# Altium project PIC.PrjPCB
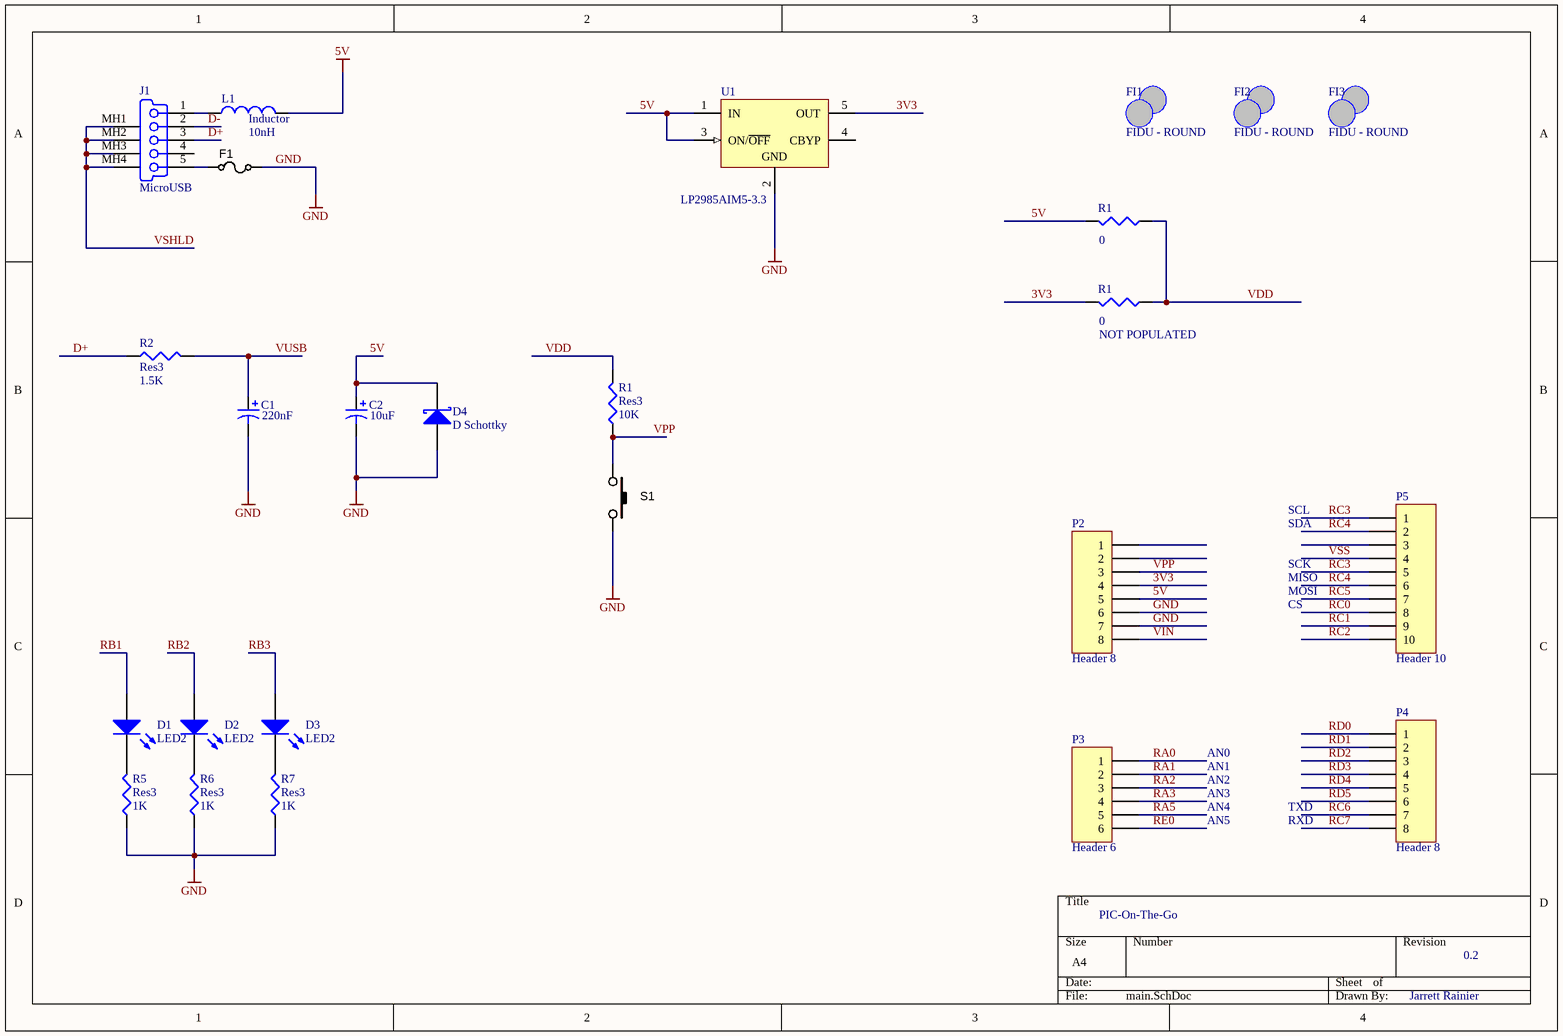
[diagram p0: main.SchDoc]
drawnBy: Jarrett Rainier; Title: HI
2 sheets, 32 parts. Net scope: global (net labels, ports and power ports of the same name join across sheets).
Board files: PCB1.PcbDoc, Panelized.PcbDoc
Sheets:
  main.SchDoc
  micros.SchDoc

## Sheet main.SchDoc: PIC-On-The-Go
size A4; Date: 5/12/15; DrawnBy: Jarrett Rainier; Revision: 0.2; SheetNumber: 1; SheetTotal: 2

### Parts
(Parts that share a designator on the sheet are numbered #1, #2 ... from top to bottom, then left to right.)
C1  value 220nF  [C0805]  (hidden comment: Cap Pol3)
C2  value 10uF  [C0805]  (hidden comment: Cap Pol3)
D1  LED2  [3.2X1.6X1.1]
D2  LED2  [3.2X1.6X1.1]
D3  LED2  [3.2X1.6X1.1]
D4  D Schottky  [SMB]
F1  Slow-blow  [RESC3216X70N]  (value not drawn)
FI1  FIDU - ROUND  [FIDU-ROUND]
FI2  FIDU - ROUND  [FIDU-ROUND]
FI3  FIDU - ROUND  [FIDU-ROUND]
J1  MicroUSB  [microusb]
L1  Inductor  value 10nH  [0402-A]
P2  Header 8  [HDR1X8]
P3  Header 6  [HDR1X6]
P4  Header 8  [HDR1X8]
P5  Header 10  [HDR1X10]
R1#1  value 0  [J1-0603]  (hidden comment: Res3)
R1#2  NOT POPULATED  value 0  [J1-0603]
R1#3  Res3  value 10K  [J1-0603]
R2  Res3  value 1.5K  [J1-0603]
R5  Res3  value 1K  [J1-0603]
R6  Res3  value 1K  [J1-0603]
R7  Res3  value 1K  [J1-0603]
S1  TS-1143S-WP  [TS-1143S]  (value not drawn)
U1  LP2985AIM5-3.3  [MF05A_N]

### Nets
5V: C2.1 D4.2(K) L1.2 P2.5 R1#1.2 U1.1(IN) U1.3(ON/~{OFF})
GND: C1.2 C2.2 D4.1(A) F1.2 P2.6 P2.7 R5.1 R6.1 R7.1 S1.2 U1.2(GND)
3V3: P2.4 R1#2.2 U1.5(OUT)
D+: J1.3(D+) R2.1
D-: J1.2(D-)
RA0: P3.1
RA1: P3.2
RA2: P3.3
RA3: P3.4
RA5: P3.5
RB1: D1.1(A)
RB2: D2.1(A)
RB3: D3.1(A)
RC0: P5.8
RC1: P5.9
RC2: P5.10
RC3: P5.1 P5.5
RC4: P5.2 P5.6
RC5: P5.7
RC6: P4.7
RC7: P4.8
RD0: P4.1
RD1: P4.2
RD2: P4.3
RD3: P4.4
RD4: P4.5
RD5: P4.6
RE0: P3.6
VDD: R1#1.1 R1#2.1 R1#3.2
VIN: P2.8
VPP: P2.3 R1#3.1 S1.1
VSHLD: J1.MH1(Tab) J1.MH2(Tab) J1.MH3(Tab) J1.MH4(Tab)
VSS: P5.4
VUSB: C1.1 R2.2
NetD1_2: D1.2(K) R5.2
NetD2_2: D2.2(K) R6.2
NetD3_2: D3.2(K) R7.2
NetF1_1: F1.1 J1.5(GND)
NetJ1_1: J1.1(V_BUS_(5V)) L1.1

Not connected (* = marked no-connect by the designer): J1 4(NC); P2 1 2; P5 3; U1 4(CBYP)

### Notes on the sheet
- SCL
- SDA
- SCK
- MISO
- MOSI
- CS
- AN0
- AN1
- AN2
- AN3
- AN4
- AN5
- TXD
- RXD

### Library data of the parts
C1 C2 = Cap Pol3: Polarized Capacitor (Surface Mount); Published: 8-Jun-2000; LatestRevisionDate: 29-May-2009; LatestRevisionNote: IPC-7351 Footprint Added.; PackageReference: C0805; Publisher: Altium Limited; PackageDescription: Chip Capacitor
D1-D3 = LED2: Typical RED, GREEN, YELLOW, AMBER GaAs LED; Published: 8-Jun-2000; LatestRevisionDate: 17-Jul-2002; LatestRevisionNote: Re-released for DXP Platform.; PackageVersion: Feb-2002; PackageReference: 3.2X1.6X1.1; Publisher: Altium Limited; PackageDescription: SM LED; 2 Flat Leads
D4 = D Schottky: Schottky Diode; Published: 8-Jun-2000; LatestRevisionDate: 17-Jul-2002; LatestRevisionNote: Re-released for DXP Platform.; PackageReference: SMB; Publisher: Altium Limited; PackageDescription: DO-214-AA/SMB; 2 C-Bend Leads; Body 5.3 x 3.6 mm, inc. leads (LxW); Code_JEDEC: DO-214-AA
F1 = FUSE_160mA_1206: Fuse 750mA 6VDC 1206 SMD; Manufacturer 1: TE Connectivity; Manufacturer Part Number 1: NANOSMDC075F-2; Ratings: 750mA; 6VDC; slow-blow; SCDType: spec; Package / Case: 1206 (3216 metric); Value: 750mA
J1 = MicroUSB: USB On-The-Go (OTG) Mini-B Receptacle, Right Angle, SMT, 0.80mm (.031") Pitch, Solder Tabs with Back Cover, Recessed Type; PCB_Layout: Complies with Manufacturer's Recommendation.; Published: 21-Sep-2007; DatasheetVersion: revA, May-2004; PackageVersion: May-2004; PackageReference: 481900001; Publisher: Altium Limited; PackageDescription: USB Mini-B, Sinking Type, SM; 5 Position; Right Angle, Body 11.45 x 11.8 x 3.9 mm (LxWxH); ComponentLink1Description: Manufacturer Link; ComponentLink1URL: http://www.molex.com/; ComponentLink2Description: Datasheet; ComponentLink2URL: http://www.molex.com/cmc_upload/0/000/895/958/SD-48190-001RevA.pdf
L1 = Inductor: Code_IEC: 1005; Published: 8-Jun-2000; LatestRevisionDate: 29-May-2009; LatestRevisionNote: IPC-7351 Footprint Added.; PackageReference: 0402-A; Publisher: Altium Limited; PackageDescription: Chip Inductor; Code_JEITA: 0402
P2 P4 = Header 8: Header, 8-Pin; LatestRevisionDate: 17-Jul-2002; LatestRevisionNote: Re-released for DXP Platform.; Publisher: Altium Limited
P3 = Header 6: Header, 6-Pin; LatestRevisionDate: 17-Jul-2002; LatestRevisionNote: Re-released for DXP Platform.; Publisher: Altium Limited
P5 = Header 10: Header, 10-Pin; LatestRevisionDate: 17-Jul-2002; LatestRevisionNote: Re-released for DXP Platform.; Publisher: Altium Limited
R1#1-R1#3 R2 R5-R7 = Res3: Resistor; Published: 8-Jun-2000; LatestRevisionDate: 29-May-2009; LatestRevisionNote: IPC-7351 Footprint Added.; PackageReference: J1-0603; Publisher: Altium Limited; PackageDescription: Chip Resistor
S1 = SW_SMD_PB_4.3mm: Switch SMD Tact 4.3mm Stem; Manufacturer 1: Bond-Tact; Manufacturer Part Number 1: TS-1143S-WP-200; SCDType: spec; Function: On/Off; Package / Case: 6.5x6.5mm; 4.3mm stem; Supplier Part Number 1: CKN10304CT-ND; Supplier 1: Digi-Key
U1 = LP2985AIM5-3.3: Micropower 150 mA Low-Noise Ultra Low-Dropout Regulator, 5-pin SOT-23; Manufacturer: National Semiconductor; PackageTopMarking: L0RA*XTT; PowerWise: N; CompType: LDO IC; Published: 4-Dec-2008; DatasheetVersion: Jul-2007; PackageVersion: revD, Aug-2008; PackageReference: MF05A; Publisher: Altium Limited; PackageDescription: Molded SOT-23, .115 x .063 x .040 in Body, 5 Lead, .0375 in Pitch; Supplier 1: Farnell; Supplier Part Number 1: 9778276; Supplier 2: Farnell; Supplier Part Number 2: 9778276RL; PartNumber: LP2985AIM5-3.3; RoHS: N; PinCount: 5; ComponentLink1Description: LP2985 Datasheet; ComponentLink1URL: http://www.national.com/ds/LP/LP2985.pdf; ComponentLink2Description: LP2985 Web Page; ComponentLink2URL: http://www.national.com/pf/LP/LP2985.html; ComponentLink3Description: MF05A Package Page; ComponentLink3URL: http://www.national.com/packaging/folders/mf05a.html

## Sheet micros.SchDoc: PIC-On-The-Go
size A4; DrawnBy: Jarrett Rainier; Revision: 0.2; SheetNumber: 2; SheetTotal: 2
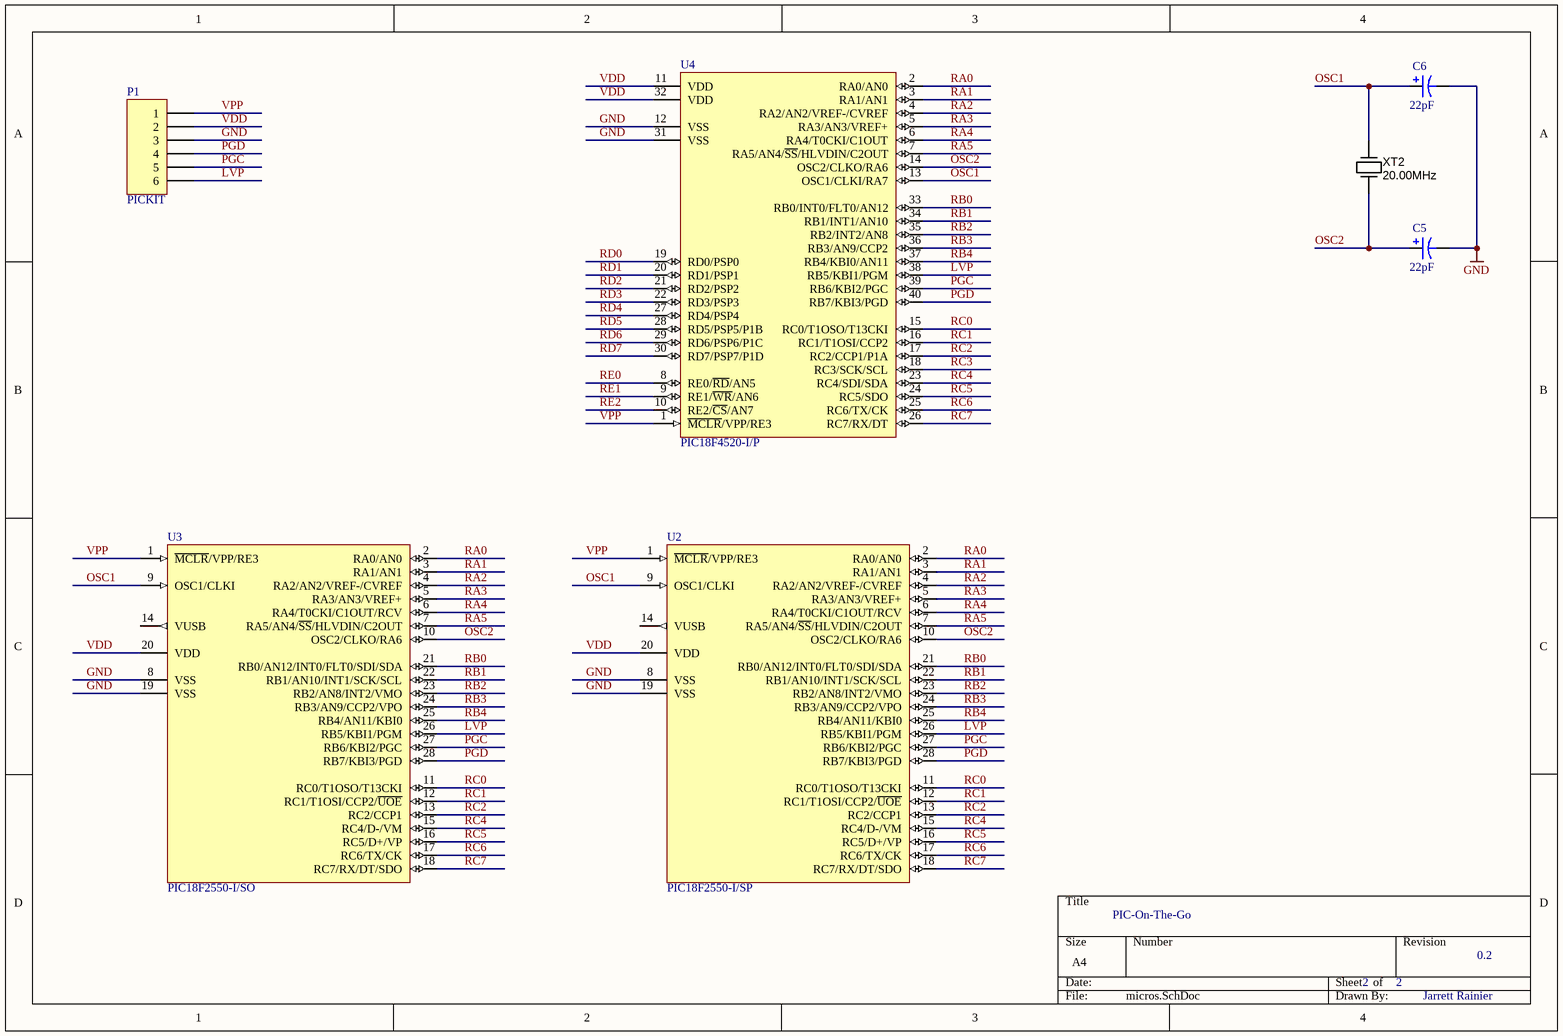
[diagram p1: micros.SchDoc]

### Parts
C5  value 22pF  [C0805]  (hidden comment: Cap Pol3)
C6  value 22pF  [C0805]  (hidden comment: Cap Pol3)
P1  PICKIT  [HDR1X6]
U2  PIC18F2550-I/SP  [SPDIP300-SP28]
U3  PIC18F2550-I/SO  [SOIC-SO28_N]
U4  PIC18F4520-I/P  [PDIP600-P40]
XT2  20.00MHz  [CRYSTAL_HC49-US-SM]

### Nets
GND: C5.2 C6.2 P1.3 U2.8(VSS) U2.19(VSS) U3.8(VSS) U3.19(VSS) U4.12(VSS) U4.31(VSS)
LVP: P1.6 U2.26(RB5/KBI1/PGM) U3.26(RB5/KBI1/PGM) U4.38(RB5/KBI1/PGM)
OSC1: C6.1 U2.9(OSC1/CLKI) U3.9(OSC1/CLKI) U4.13(OSC1/CLKI/RA7) XT2.2(OUT)
OSC2: C5.1 U2.10(OSC2/CLKO/RA6) U3.10(OSC2/CLKO/RA6) U4.14(OSC2/CLKO/RA6) XT2.1(IN)
PGC: P1.5 U2.27(RB6/KBI2/PGC) U3.27(RB6/KBI2/PGC) U4.39(RB6/KBI2/PGC)
PGD: P1.4 U2.28(RB7/KBI3/PGD) U3.28(RB7/KBI3/PGD) U4.40(RB7/KBI3/PGD)
RA0: U2.2(RA0/AN0) U3.2(RA0/AN0) U4.2(RA0/AN0)
RA1: U2.3(RA1/AN1) U3.3(RA1/AN1) U4.3(RA1/AN1)
RA2: U2.4(RA2/AN2/VREF-/CVREF) U3.4(RA2/AN2/VREF-/CVREF) U4.4(RA2/AN2/VREF-/CVREF)
RA3: U2.5(RA3/AN3/VREF+) U3.5(RA3/AN3/VREF+) U4.5(RA3/AN3/VREF+)
RA4: U2.6(RA4/T0CKI/C1OUT/RCV) U3.6(RA4/T0CKI/C1OUT/RCV) U4.6(RA4/T0CKI/C1OUT)
RA5: U2.7(RA5/AN4/~{SS}/HLVDIN/C2OUT) U3.7(RA5/AN4/~{SS}/HLVDIN/C2OUT) U4.7(RA5/AN4/~{SS}/HLVDIN/C2OUT)
RB0: U2.21(RB0/AN12/INT0/FLT0/SDI/SDA) U3.21(RB0/AN12/INT0/FLT0/SDI/SDA) U4.33(RB0/INT0/FLT0/AN12)
RB1: U2.22(RB1/AN10/INT1/SCK/SCL) U3.22(RB1/AN10/INT1/SCK/SCL) U4.34(RB1/INT1/AN10)
RB2: U2.23(RB2/AN8/INT2/VMO) U3.23(RB2/AN8/INT2/VMO) U4.35(RB2/INT2/AN8)
RB3: U2.24(RB3/AN9/CCP2/VPO) U3.24(RB3/AN9/CCP2/VPO) U4.36(RB3/AN9/CCP2)
RB4: U2.25(RB4/AN11/KBI0) U3.25(RB4/AN11/KBI0) U4.37(RB4/KBI0/AN11)
RC0: U2.11(RC0/T1OSO/T13CKI) U3.11(RC0/T1OSO/T13CKI) U4.15(RC0/T1OSO/T13CKI)
RC1: U2.12(RC1/T1OSI/CCP2/~{UOE}) U3.12(RC1/T1OSI/CCP2/~{UOE}) U4.16(RC1/T1OSI/CCP2)
RC2: U2.13(RC2/CCP1) U3.13(RC2/CCP1) U4.17(RC2/CCP1/P1A)
RC3: U4.18(RC3/SCK/SCL)
RC4: U2.15(RC4/D-/VM) U3.15(RC4/D-/VM) U4.23(RC4/SDI/SDA)
RC5: U2.16(RC5/D+/VP) U3.16(RC5/D+/VP) U4.24(RC5/SDO)
RC6: U2.17(RC6/TX/CK) U3.17(RC6/TX/CK) U4.25(RC6/TX/CK)
RC7: U2.18(RC7/RX/DT/SDO) U3.18(RC7/RX/DT/SDO) U4.26(RC7/RX/DT)
RD0: U4.19(RD0/PSP0)
RD1: U4.20(RD1/PSP1)
RD2: U4.21(RD2/PSP2)
RD3: U4.22(RD3/PSP3)
RD4: U4.27(RD4/PSP4)
RD5: U4.28(RD5/PSP5/P1B)
RD6: U4.29(RD6/PSP6/P1C)
RD7: U4.30(RD7/PSP7/P1D)
RE0: U4.8(RE0/~{RD}/AN5)
RE1: U4.9(RE1/~{WR}/AN6)
RE2: U4.10(RE2/~{CS}/AN7)
VDD: P1.2 U2.20(VDD) U3.20(VDD) U4.11(VDD) U4.32(VDD)
VPP: P1.1 U2.1(~{MCLR}/VPP/RE3) U3.1(~{MCLR}/VPP/RE3) U4.1(~{MCLR}/VPP/RE3)

Not connected (* = marked no-connect by the designer): U2 14(VUSB); U3 14(VUSB)

### Library data of the parts
C5 C6 = Cap Pol3: Polarized Capacitor (Surface Mount); Published: 8-Jun-2000; LatestRevisionDate: 29-May-2009; LatestRevisionNote: IPC-7351 Footprint Added.; PackageReference: C0805; Publisher: Altium Limited; PackageDescription: Chip Capacitor; Supplier Part Number 1: *
P1 = Header 6: Header, 6-Pin; LatestRevisionDate: 17-Jul-2002; LatestRevisionNote: Re-released for DXP Platform.; Publisher: Altium Limited
U2 = PIC18F2550-I/SP: High Performance, Enhanced Flash, USB Microcontroller with nanoWatt Technology, 32K Flash, 28-Pin SPDIP, Industrial Temperature Range; Published: 29-Jan-2009; LatestRevisionDate: 02-Dec-2009; LatestRevisionNote: Updated to datasheet revision E, Aug-2008; DatasheetVersion: revE, Aug-2008; PackageVersion: revBB, Aug-2009; PackageReference: SPDIP300-SP28; Publisher: Altium Limited; PackageDescription: 28-Lead Skinny Plastic Dual In-Line (SP) - 300 mil Body [SPDIP]; Supplier 1: Digi-Key; Supplier Part Number 1: PIC18F2550-I/SP-ND; Supplier 2: Farnell; Supplier Part Number 2: 9321250; Supplier 3: Farnell; Supplier Part Number 3: 1523822; ComponentLink1Description: Datasheet; ComponentLink1URL: http://ww1.microchip.com/downloads/en/DeviceDoc/39632e.pdf; ComponentLink2Description: Packaging Specification; ComponentLink2URL: http://www.microchip.com/stellent/groups/techpub_sg/documents/packagingspec/en012702.pdf; ComponentLink3Description: Microchip.com Home; ComponentLink3URL: http://www.microchip.com/
U3 = PIC18F2550-I/SO: High Performance, Enhanced Flash, USB Microcontroller with nanoWatt Technology, 32K Flash, 28-Pin SOIC, Industrial Temperature Range; Published: 29-Jan-2009; LatestRevisionDate: 02-Dec-2009; LatestRevisionNote: Updated to datasheet revision E, Aug-2008; DatasheetVersion: revE, Aug-2008; PackageVersion: revBB, Aug-2009; PackageReference: SOIC-SO28; Publisher: Altium Limited; PackageDescription: 28-Lead Plastic Small Outline (SO) - Wide 7.50mm Body [SOIC]; Supplier 1: Digi-Key; Supplier Part Number 1: PIC18F2550-I/SO-ND; Supplier 2: Farnell; Supplier Part Number 2: 1660053; Supplier 3: Farnell; Supplier Part Number 3: 9321268; Code_JEDEC: MS-013; ComponentLink1Description: Datasheet; ComponentLink1URL: http://ww1.microchip.com/downloads/en/DeviceDoc/39632e.pdf; ComponentLink2Description: Packaging Specification; ComponentLink2URL: http://www.microchip.com/stellent/groups/techpub_sg/documents/packagingspec/en012702.pdf; ComponentLink3Description: Microchip.com Home; ComponentLink3URL: http://www.microchip.com/
U4 = PIC18F4520-I/P: Enhanced Flash Microcontroller with 10-Bit A/D and nanoWatt Technology, 32K Flash, 40-Pin PDIP, Industrial Temperature Range; Published: 29-Jan-2009; LatestRevisionDate: 02-Dec-2009; LatestRevisionNote: Updated to datasheet revision E, Oct-2008; DatasheetVersion: revE, Oct-2008; PackageVersion: revBB, Aug-2009; PackageReference: PDIP600-P40; Publisher: Altium Limited; PackageDescription: 40-Lead Plastic Dual In-Line (P) - 600 mil Body [PDIP]; Supplier 1: Digi-Key; Supplier Part Number 1: PIC18F4520-I/P-ND; Supplier 2: Farnell; Supplier Part Number 2: 1523812; Supplier 3: Farnell; Supplier Part Number 3: 1212702; ComponentLink1Description: Datasheet; ComponentLink1URL: http://ww1.microchip.com/downloads/en/DeviceDoc/39631E.pdf; ComponentLink2Description: Packaging Specification; ComponentLink2URL: http://www.microchip.com/stellent/groups/techpub_sg/documents/packagingspec/en012702.pdf; ComponentLink3Description: Microchip.com Home; ComponentLink3URL: http://www.microchip.com/
XT2 = Crystal_6MHz_HC49/US: Resonator Ceramic 20.00 MHz 30ppm; Manufacturer 1: CTS-Frequency Controls; Manufacturer Part Number 1: ATS060BSM-1; Frequency: 20MHz; Frequency Stability: ±50ppm; Load Capacitance: 18pF; Operating Mode: Fundamental; Parameter Name: 0.169" (4.30mm); SCDType: spec; Package / Case: HC49/US-SM; Ratings: 20.00 MHz; Supplier 1: Digi-Key; Supplier Part Number 1: XC1254CT-ND; Type: MHz Crystal; Frequency Tolerance: ±30ppm; Operating Temperature: -20°C ~ 70°C; Mounting Type: Surface Mount; Size / Dimension: 0.437" L x 0.190" W (11.10mm x 4.83mm); ComponentLink1URL: http://www.ctscorp.com/components/Datasheets/008-0309-0.pdf; ComponentLink1Description: http://www.ctscorp.com/components/Datasheets/008-0309-0.pdf

## Nets that join several sheets
GND: main (11 pins), micros (9 pins)
RA0: main (P3.1), micros (U2.2 U3.2 U4.2)
RA1: main (P3.2), micros (U2.3 U3.3 U4.3)
RA2: main (P3.3), micros (U2.4 U3.4 U4.4)
RA3: main (P3.4), micros (U2.5 U3.5 U4.5)
RA5: main (P3.5), micros (U2.7 U3.7 U4.7)
RB1: main (D1.1), micros (U2.22 U3.22 U4.34)
RB2: main (D2.1), micros (U2.23 U3.23 U4.35)
RB3: main (D3.1), micros (U2.24 U3.24 U4.36)
RC0: main (P5.8), micros (U2.11 U3.11 U4.15)
RC1: main (P5.9), micros (U2.12 U3.12 U4.16)
RC2: main (P5.10), micros (U2.13 U3.13 U4.17)
RC3: main (P5.1 P5.5), micros (U4.18)
RC4: main (P5.2 P5.6), micros (U2.15 U3.15 U4.23)
RC5: main (P5.7), micros (U2.16 U3.16 U4.24)
RC6: main (P4.7), micros (U2.17 U3.17 U4.25)
RC7: main (P4.8), micros (U2.18 U3.18 U4.26)
RD0: main (P4.1), micros (U4.19)
RD1: main (P4.2), micros (U4.20)
RD2: main (P4.3), micros (U4.21)
RD3: main (P4.4), micros (U4.22)
RD4: main (P4.5), micros (U4.27)
RD5: main (P4.6), micros (U4.28)
RE0: main (P3.6), micros (U4.8)
VDD: main (R1#1.1 R1#2.1 R1#3.2), micros (5 pins)
VPP: main (P2.3 R1#3.1 S1.1), micros (P1.1 U2.1 U3.1 U4.1)